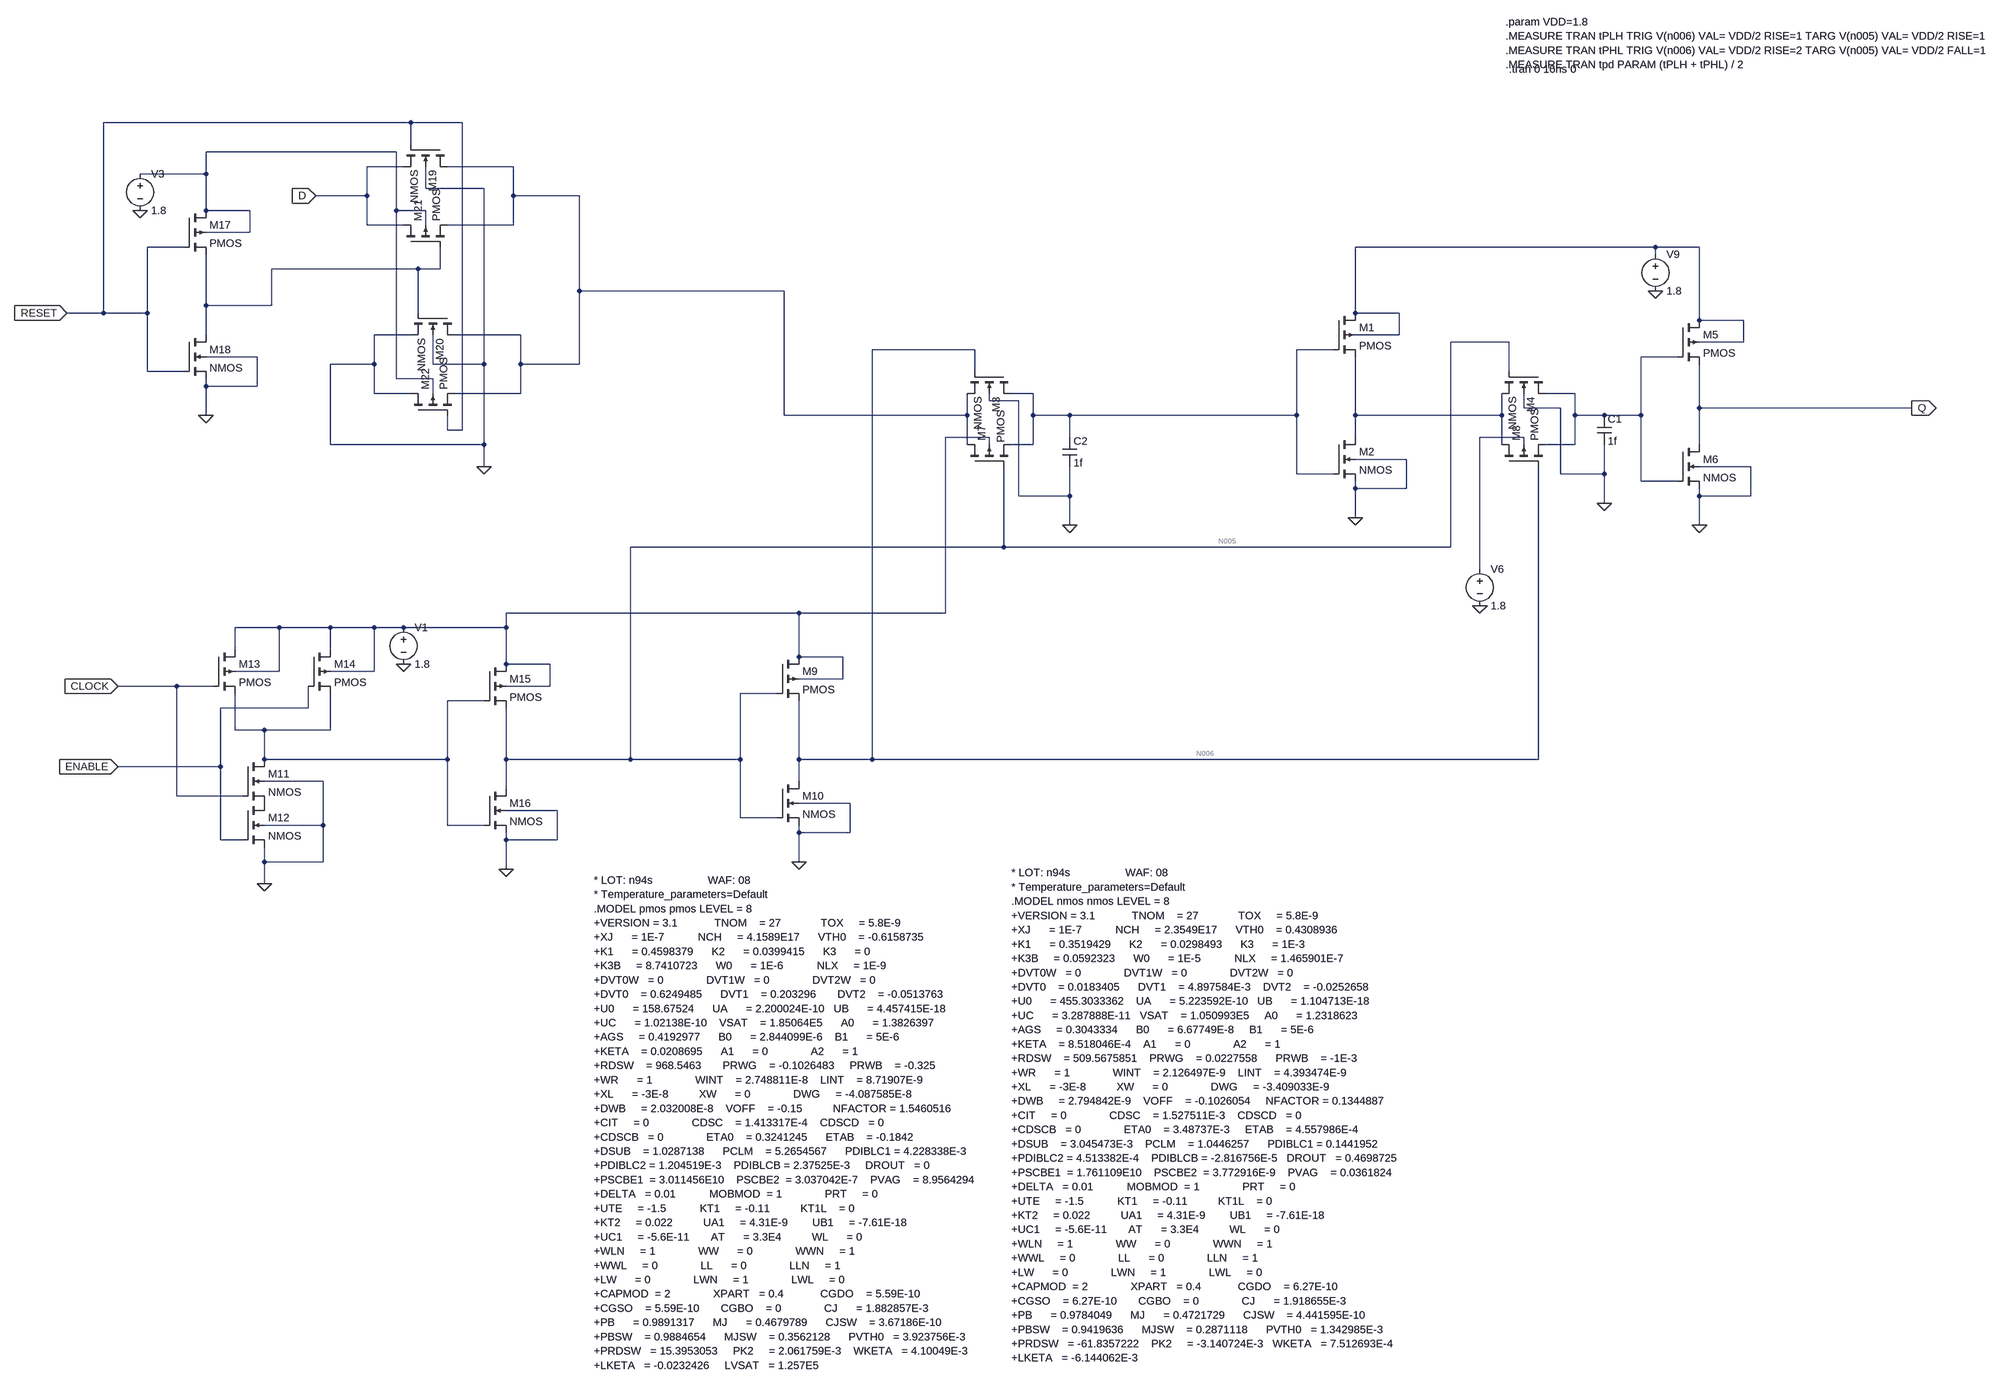
[diagram p0: schematic DFF_TG_INV_Ctrls.asc]
DFF_TG_INV_Ctrls.asc, the LTspice schematic file:
Version 4
SHEET 1 1972 1916
WIRE -3360 -736 -4032 -736
WIRE -3248 -736 -3360 -736
WIRE -3360 -688 -3360 -736
WIRE -3392 -672 -3808 -672
WIRE -3376 -640 -3456 -640
WIRE -3136 -640 -3280 -640
WIRE -3808 -624 -3808 -672
WIRE -3808 -624 -3952 -624
WIRE -3328 -592 -3328 -640
WIRE -3200 -592 -3328 -592
WIRE -3456 -576 -3456 -640
WIRE -3456 -576 -3568 -576
WIRE -3136 -576 -3136 -640
WIRE -2992 -576 -3136 -576
WIRE -3808 -544 -3808 -624
WIRE -3712 -544 -3808 -544
WIRE -3392 -544 -3392 -672
WIRE -3328 -544 -3392 -544
WIRE -3456 -512 -3456 -576
WIRE -3376 -512 -3456 -512
WIRE -3328 -512 -3328 -544
WIRE -3136 -512 -3136 -576
WIRE -3136 -512 -3280 -512
WIRE -3712 -496 -3712 -544
WIRE -3712 -496 -3808 -496
WIRE -3856 -464 -3936 -464
WIRE -640 -464 -1296 -464
WIRE -544 -464 -640 -464
WIRE -640 -448 -640 -464
WIRE -3344 -416 -3664 -416
WIRE -3296 -416 -3296 -464
WIRE -3296 -416 -3344 -416
WIRE -2992 -368 -2992 -576
WIRE -2544 -368 -2992 -368
WIRE -3808 -336 -3808 -448
WIRE -3664 -336 -3664 -416
WIRE -3664 -336 -3808 -336
WIRE -4032 -320 -4032 -736
WIRE -4032 -320 -4112 -320
WIRE -3936 -320 -3936 -464
WIRE -3936 -320 -4032 -320
WIRE -3344 -320 -3344 -416
WIRE -1296 -320 -1296 -464
WIRE -1200 -320 -1296 -320
WIRE -544 -304 -544 -464
WIRE -448 -304 -544 -304
WIRE -3808 -272 -3808 -336
WIRE -3360 -272 -3440 -272
WIRE -3120 -272 -3264 -272
WIRE -1200 -272 -1200 -320
WIRE -1200 -272 -1296 -272
WIRE -960 -256 -1088 -256
WIRE -448 -256 -448 -304
WIRE -448 -256 -544 -256
WIRE -2128 -240 -2352 -240
WIRE -1344 -240 -1424 -240
WIRE -3696 -224 -3808 -224
WIRE -592 -224 -672 -224
WIRE -3440 -208 -3440 -272
WIRE -3440 -208 -3536 -208
WIRE -3312 -208 -3312 -272
WIRE -3200 -208 -3200 -592
WIRE -3200 -208 -3312 -208
WIRE -3120 -208 -3120 -272
WIRE -2992 -208 -2992 -368
WIRE -2992 -208 -3120 -208
WIRE -3936 -192 -3936 -320
WIRE -3856 -192 -3936 -192
WIRE -2128 -192 -2128 -240
WIRE -960 -192 -960 -256
WIRE -3392 -176 -3392 -544
WIRE -3312 -176 -3392 -176
WIRE -3808 -160 -3808 -176
WIRE -3696 -160 -3696 -224
WIRE -3696 -160 -3808 -160
WIRE -3440 -144 -3440 -208
WIRE -3360 -144 -3440 -144
WIRE -3312 -144 -3312 -176
WIRE -3120 -144 -3120 -208
WIRE -3120 -144 -3264 -144
WIRE -2000 -144 -2048 -144
WIRE -816 -144 -880 -144
WIRE -2096 -128 -2096 -144
WIRE -2032 -128 -2096 -128
WIRE -928 -112 -928 -144
WIRE -848 -112 -928 -112
WIRE -544 -112 -544 -208
WIRE -80 -112 -544 -112
WIRE -3808 -96 -3808 -160
WIRE -2544 -96 -2544 -368
WIRE -2144 -96 -2144 -144
WIRE -2144 -96 -2544 -96
WIRE -2000 -96 -2000 -144
WIRE -1920 -96 -2000 -96
WIRE -1424 -96 -1424 -240
WIRE -1424 -96 -1920 -96
WIRE -1296 -96 -1296 -224
WIRE -976 -96 -976 -144
WIRE -976 -96 -1296 -96
WIRE -816 -96 -816 -144
WIRE -752 -96 -816 -96
WIRE -672 -96 -672 -224
WIRE -672 -96 -752 -96
WIRE -3280 -64 -3280 -96
WIRE -3248 -64 -3248 -736
WIRE -3248 -64 -3280 -64
WIRE -2096 -48 -2192 -48
WIRE -1920 -48 -1920 -96
WIRE -1296 -48 -1296 -96
WIRE -928 -48 -1024 -48
WIRE -3536 -32 -3536 -208
WIRE -3200 -32 -3200 -208
WIRE -3200 -32 -3536 -32
WIRE -2144 -32 -2144 -96
WIRE -2096 -32 -2096 -48
WIRE -2000 -32 -2000 -96
WIRE -2000 -32 -2048 -32
WIRE -976 -32 -976 -96
WIRE -928 -32 -928 -48
WIRE -816 -32 -816 -96
WIRE -816 -32 -880 -32
WIRE -544 -32 -544 -112
WIRE -1184 0 -1296 0
WIRE -3200 16 -3200 -32
WIRE -432 16 -544 16
WIRE -1424 32 -1424 -96
WIRE -1344 32 -1424 32
WIRE -848 32 -848 -112
WIRE -752 32 -752 -32
WIRE -752 32 -848 32
WIRE -672 48 -672 -96
WIRE -592 48 -672 48
WIRE -1296 64 -1296 48
WIRE -1184 64 -1184 0
WIRE -1184 64 -1296 64
WIRE -2032 80 -2032 -128
WIRE -1920 80 -1920 16
WIRE -1920 80 -2032 80
WIRE -544 80 -544 64
WIRE -432 80 -432 16
WIRE -432 80 -544 80
WIRE -752 96 -752 32
WIRE -1296 128 -1296 64
WIRE -1920 144 -1920 80
WIRE -544 144 -544 80
WIRE -2064 192 -2064 16
WIRE -2064 192 -2880 192
WIRE -1088 192 -1088 -256
WIRE -1088 192 -2064 192
WIRE -1024 240 -1024 -48
WIRE -2512 336 -3152 336
WIRE -2192 336 -2192 -48
WIRE -2192 336 -2512 336
WIRE -3648 368 -3744 368
WIRE -3536 368 -3648 368
WIRE -3440 368 -3536 368
WIRE -3376 368 -3440 368
WIRE -3152 368 -3152 336
WIRE -3152 368 -3376 368
WIRE -3744 416 -3744 368
WIRE -3536 416 -3536 368
WIRE -2512 432 -2512 336
WIRE -2416 432 -2512 432
WIRE -3152 448 -3152 368
WIRE -3056 448 -3152 448
WIRE -3648 464 -3648 368
WIRE -3648 464 -3744 464
WIRE -3440 464 -3440 368
WIRE -3440 464 -3536 464
WIRE -2416 480 -2416 432
WIRE -2416 480 -2512 480
WIRE -3872 496 -4000 496
WIRE -3792 496 -3872 496
WIRE -3056 496 -3056 448
WIRE -3056 496 -3152 496
WIRE -2560 512 -2640 512
WIRE -3200 528 -3280 528
WIRE -3584 544 -3584 496
WIRE -3584 544 -3776 544
WIRE -3744 592 -3744 512
WIRE -3680 592 -3744 592
WIRE -3536 592 -3536 512
WIRE -3536 592 -3680 592
WIRE -3680 656 -3680 592
WIRE -3280 656 -3280 528
WIRE -3280 656 -3680 656
WIRE -3152 656 -3152 544
WIRE -2880 656 -2880 192
WIRE -2880 656 -3152 656
WIRE -2640 656 -2640 512
WIRE -2640 656 -2880 656
WIRE -2512 656 -2512 528
WIRE -2352 656 -2352 -240
WIRE -2352 656 -2512 656
WIRE -896 656 -896 16
WIRE -896 656 -2352 656
WIRE -3776 672 -3776 544
WIRE -3776 672 -4000 672
WIRE -3552 704 -3680 704
WIRE -2512 704 -2512 656
WIRE -3152 720 -3152 656
WIRE -3872 736 -3872 496
WIRE -3728 736 -3872 736
WIRE -2400 752 -2512 752
WIRE -3040 768 -3152 768
WIRE -2640 784 -2640 656
WIRE -2560 784 -2640 784
WIRE -3552 800 -3552 704
WIRE -3552 800 -3680 800
WIRE -3280 800 -3280 656
WIRE -3200 800 -3280 800
WIRE -2512 816 -2512 800
WIRE -2400 816 -2400 752
WIRE -2400 816 -2512 816
WIRE -3776 832 -3776 672
WIRE -3728 832 -3776 832
WIRE -3152 832 -3152 816
WIRE -3040 832 -3040 768
WIRE -3040 832 -3152 832
WIRE -3680 880 -3680 848
WIRE -3552 880 -3552 800
WIRE -3552 880 -3680 880
WIRE -2512 880 -2512 816
WIRE -3152 896 -3152 832
WIRE -3680 928 -3680 880
FLAG -1296 128 0
FLAG -544 144 0
FLAG -752 96 0
FLAG -1920 144 0
FLAG -2512 880 0
FLAG -80 -112 Q
IOPIN -80 -112 Out
FLAG -3376 448 0
FLAG -3680 928 0
FLAG -4000 672 ENABLE
IOPIN -4000 672 In
FLAG -4000 496 CLOCK
IOPIN -4000 496 In
FLAG -3152 896 0
FLAG -3952 -544 0
FLAG -4112 -320 RESET
IOPIN -4112 -320 In
FLAG -3808 -96 0
FLAG -3200 16 0
FLAG -3568 -576 D
IOPIN -3568 -576 In
FLAG -1024 320 0
FLAG -640 -368 0
SYMBOL nmos4 -2048 -192 R90
SYMATTR InstName M3
SYMATTR Value2 l=180n w=440n
SYMBOL nmos4 -880 -192 R90
SYMATTR InstName M4
SYMATTR Value2 l=180n w=440n
SYMBOL Cap -768 -96 R0
SYMATTR InstName C1
SYMATTR Value 1f
SYMBOL pmos4 -1344 -320 R0
SYMATTR InstName M1
SYMATTR Value2 l=180n w=880n
SYMBOL nmos4 -1344 -48 R0
SYMATTR InstName M2
SYMATTR Value2 l=180n w=440n
SYMBOL pmos4 -592 -304 R0
SYMATTR InstName M5
SYMATTR Value2 l=180n w=880n
SYMBOL nmos4 -592 -32 R0
SYMATTR InstName M6
SYMATTR Value2 l=180n w=440n
SYMBOL pmos4 -2144 16 R270
WINDOW 3 52 74 Left 2
SYMATTR InstName M7
SYMATTR Value2 l=180n w=440n
SYMBOL pmos4 -976 16 R270
SYMATTR InstName M8
SYMATTR Value2 l=180n w=440n
SYMBOL Cap -1936 -48 R0
SYMATTR InstName C2
SYMATTR Value 1f
SYMBOL pmos4 -2560 432 R0
SYMATTR InstName M9
SYMATTR Value2 l=180n w=880n
SYMBOL nmos4 -2560 704 R0
SYMATTR InstName M10
SYMATTR Value2 l=180n w=440n
SYMBOL nmos4 -3728 656 R0
SYMATTR InstName M11
SYMATTR Value2 l=180n w=880n
SYMBOL nmos4 -3728 752 R0
SYMATTR InstName M12
SYMATTR Value2 l=180n w=880n
SYMBOL pmos4 -3792 416 R0
SYMATTR InstName M13
SYMATTR Value2 l=180n w=880n
SYMBOL pmos4 -3584 416 R0
SYMATTR InstName M14
SYMATTR Value2 l=180n w=880n
SYMBOL Voltage -3376 352 R0
SYMATTR InstName V1
SYMATTR Value 1.8
SYMBOL pmos4 -3200 448 R0
SYMATTR InstName M15
SYMATTR Value2 l=180n w=880n
SYMBOL nmos4 -3200 720 R0
SYMATTR InstName M16
SYMATTR Value2 l=180n w=440n
SYMBOL Voltage -3952 -640 R0
SYMATTR InstName V3
SYMATTR Value 1.8
SYMBOL pmos4 -3856 -544 R0
SYMATTR InstName M17
SYMATTR Value2 l=180n w=880n
SYMBOL nmos4 -3856 -272 R0
SYMATTR InstName M18
SYMATTR Value2 l=180n w=440n
SYMBOL nmos4 -3280 -688 R90
SYMATTR InstName M19
SYMATTR Value2 l=180n w=440n
SYMBOL nmos4 -3264 -320 R90
SYMATTR InstName M20
SYMATTR Value2 l=180n w=440n
SYMBOL pmos4 -3376 -464 R270
SYMATTR InstName M21
SYMATTR Value2 l=180n w=440n
SYMBOL pmos4 -3360 -96 R270
SYMATTR InstName M22
SYMATTR Value2 l=180n w=440n
SYMBOL Voltage -1024 224 R0
SYMATTR InstName V6
SYMATTR Value 1.8
SYMBOL Voltage -640 -464 R0
SYMATTR InstName V9
SYMATTR Value 1.8
TEXT -960 -856 Left 2 !.tran 0 16ns 0
TEXT -968 -960 Left 2 !.param VDD=1.8\n.MEASURE TRAN tPLH TRIG V(n006) VAL= VDD/2 RISE=1 TARG V(n005) VAL= VDD/2 RISE=1\n.MEASURE TRAN tPHL TRIG V(n006) VAL= VDD/2 RISE=2 TARG V(n005) VAL= VDD/2 FALL=1\n.MEASURE TRAN tpd PARAM (tPLH + tPHL) / 2
TEXT -2048 904 Left 2 !* LOT: n94s                  WAF: 08\n* Temperature_parameters=Default\n.MODEL nmos nmos LEVEL = 8\n+VERSION = 3.1            TNOM    = 27             TOX     = 5.8E-9\n+XJ      = 1E-7           NCH     = 2.3549E17      VTH0    = 0.4308936\n+K1      = 0.3519429      K2      = 0.0298493      K3      = 1E-3\n+K3B     = 0.0592323      W0      = 1E-5           NLX     = 1.465901E-7\n+DVT0W   = 0              DVT1W   = 0              DVT2W   = 0\n+DVT0    = 0.0183405      DVT1    = 4.897584E-3    DVT2    = -0.0252658\n+U0      = 455.3033362    UA      = 5.223592E-10   UB      = 1.104713E-18\n+UC      = 3.287888E-11   VSAT    = 1.050993E5     A0      = 1.2318623\n+AGS     = 0.3043334      B0      = 6.67749E-8     B1      = 5E-6\n+KETA    = 8.518046E-4    A1      = 0              A2      = 1\n+RDSW    = 509.5675851    PRWG    = 0.0227558      PRWB    = -1E-3\n+WR      = 1              WINT    = 2.126497E-9    LINT    = 4.393474E-9\n+XL      = -3E-8          XW      = 0              DWG     = -3.409033E-9\n+DWB     = 2.794842E-9    VOFF    = -0.1026054     NFACTOR = 0.1344887\n+CIT     = 0              CDSC    = 1.527511E-3    CDSCD   = 0\n+CDSCB   = 0              ETA0    = 3.48737E-3     ETAB    = 4.557986E-4\n+DSUB    = 3.045473E-3    PCLM    = 1.0446257      PDIBLC1 = 0.1441952\n+PDIBLC2 = 4.513382E-4    PDIBLCB = -2.816756E-5   DROUT   = 0.4698725\n+PSCBE1  = 1.761109E10    PSCBE2  = 3.772916E-9    PVAG    = 0.0361824\n+DELTA   = 0.01           MOBMOD  = 1              PRT     = 0\n+UTE     = -1.5           KT1     = -0.11          KT1L    = 0\n+KT2     = 0.022          UA1     = 4.31E-9        UB1     = -7.61E-18\n+UC1     = -5.6E-11       AT      = 3.3E4          WL      = 0\n+WLN     = 1              WW      = 0              WWN     = 1\n+WWL     = 0              LL      = 0              LLN     = 1\n+LW      = 0              LWN     = 1              LWL     = 0\n+CAPMOD  = 2              XPART   = 0.4            CGDO    = 6.27E-10\n+CGSO    = 6.27E-10       CGBO    = 0              CJ      = 1.918655E-3\n+PB      = 0.9784049      MJ      = 0.4721729      CJSW    = 4.441595E-10\n+PBSW    = 0.9419636      MJSW    = 0.2871118      PVTH0   = 1.342985E-3\n+PRDSW   = -61.8357222    PK2     = -3.140724E-3   WKETA   = 7.512693E-4\n+LKETA   = -6.144062E-3
TEXT -2960 920 Left 2 !* LOT: n94s                  WAF: 08\n* Temperature_parameters=Default\n.MODEL pmos pmos LEVEL = 8\n+VERSION = 3.1            TNOM    = 27             TOX     = 5.8E-9\n+XJ      = 1E-7           NCH     = 4.1589E17      VTH0    = -0.6158735\n+K1      = 0.4598379      K2      = 0.0399415      K3      = 0\n+K3B     = 8.7410723      W0      = 1E-6           NLX     = 1E-9\n+DVT0W   = 0              DVT1W   = 0              DVT2W   = 0\n+DVT0    = 0.6249485      DVT1    = 0.203296       DVT2    = -0.0513763\n+U0      = 158.67524      UA      = 2.200024E-10   UB      = 4.457415E-18\n+UC      = 1.02138E-10    VSAT    = 1.85064E5      A0      = 1.3826397\n+AGS     = 0.4192977      B0      = 2.844099E-6    B1      = 5E-6\n+KETA    = 0.0208695      A1      = 0              A2      = 1\n+RDSW    = 968.5463       PRWG    = -0.1026483     PRWB    = -0.325\n+WR      = 1              WINT    = 2.748811E-8    LINT    = 8.71907E-9\n+XL      = -3E-8          XW      = 0              DWG     = -4.087585E-8\n+DWB     = 2.032008E-8    VOFF    = -0.15          NFACTOR = 1.5460516\n+CIT     = 0              CDSC    = 1.413317E-4    CDSCD   = 0\n+CDSCB   = 0              ETA0    = 0.3241245      ETAB    = -0.1842\n+DSUB    = 1.0287138      PCLM    = 5.2654567      PDIBLC1 = 4.228338E-3\n+PDIBLC2 = 1.204519E-3    PDIBLCB = 2.37525E-3     DROUT   = 0\n+PSCBE1  = 3.011456E10    PSCBE2  = 3.037042E-7    PVAG    = 8.9564294\n+DELTA   = 0.01           MOBMOD  = 1              PRT     = 0\n+UTE     = -1.5           KT1     = -0.11          KT1L    = 0\n+KT2     = 0.022          UA1     = 4.31E-9        UB1     = -7.61E-18\n+UC1     = -5.6E-11       AT      = 3.3E4          WL      = 0\n+WLN     = 1              WW      = 0              WWN     = 1\n+WWL     = 0              LL      = 0              LLN     = 1\n+LW      = 0              LWN     = 1              LWL     = 0\n+CAPMOD  = 2              XPART   = 0.4            CGDO    = 5.59E-10\n+CGSO    = 5.59E-10       CGBO    = 0              CJ      = 1.882857E-3\n+PB      = 0.9891317      MJ      = 0.4679789      CJSW    = 3.67186E-10\n+PBSW    = 0.9884654      MJSW    = 0.3562128      PVTH0   = 3.923756E-3\n+PRDSW   = 15.3953053     PK2     = 2.061759E-3    WKETA   = 4.10049E-3\n+LKETA   = -0.0232426     LVSAT   = 1.257E5

The netlist it stands for:
* DFF_TG_INV_Ctrls.asc
M3 N007 N006 N002 0 NMOS l=180n w=440n
M4 N008 N005 N009 0 NMOS l=180n w=440n
C1 N008 0 1f
M1 N003 N007 N009 N003 PMOS l=180n w=880n
M2 N009 N007 0 0 NMOS l=180n w=440n
M5 N003 N008 Q N003 PMOS l=180n w=880n
M6 Q N008 0 0 NMOS l=180n w=440n
M7 N002 N005 N007 N010 PMOS l=180n w=440n
M8 N009 N006 N008 N011 PMOS l=180n w=440n
C2 N007 0 1f
M9 N010 N005 N006 N010 PMOS l=180n w=880n
M10 N006 N005 0 0 NMOS l=180n w=440n
M11 N012 CLOCK P001 0 NMOS l=180n w=880n
M12 P001 ENABLE 0 0 NMOS l=180n w=880n
M13 N010 CLOCK N012 N010 PMOS l=180n w=880n
M14 N010 ENABLE N012 N010 PMOS l=180n w=880n
V1 N010 0 1.8
M15 N010 N012 N005 N010 PMOS l=180n w=880n
M16 N005 N012 0 0 NMOS l=180n w=440n
V3 N001 0 1.8
M17 N001 RESET N004 N001 PMOS l=180n w=880n
M18 N004 RESET 0 0 NMOS l=180n w=440n
M19 N002 RESET D 0 NMOS l=180n w=440n
M20 N002 N004 0 0 NMOS l=180n w=440n
M21 D N004 N002 N001 PMOS l=180n w=440n
M22 0 RESET N002 N001 PMOS l=180n w=440n
V6 N011 0 1.8
V9 N003 0 1.8
.model NMOS NMOS
.model PMOS PMOS
.lib standard.mos
.tran 0 16ns 0
.param VDD=1.8
.MEASURE TRAN tPLH TRIG V(n006) VAL= VDD/2 RISE=1 TARG V(n005) VAL= VDD/2 RISE=1
.MEASURE TRAN tPHL TRIG V(n006) VAL= VDD/2 RISE=2 TARG V(n005) VAL= VDD/2 FALL=1
.MEASURE TRAN tpd PARAM (tPLH + tPHL) / 2
* LOT: n94s                  WAF: 08
* Temperature_parameters=Default
.MODEL nmos nmos LEVEL = 8
+VERSION = 3.1            TNOM    = 27             TOX     = 5.8E-9
+XJ      = 1E-7           NCH     = 2.3549E17      VTH0    = 0.4308936
+K1      = 0.3519429      K2      = 0.0298493      K3      = 1E-3
+K3B     = 0.0592323      W0      = 1E-5           NLX     = 1.465901E-7
+DVT0W   = 0              DVT1W   = 0              DVT2W   = 0
+DVT0    = 0.0183405      DVT1    = 4.897584E-3    DVT2    = -0.0252658
+U0      = 455.3033362    UA      = 5.223592E-10   UB      = 1.104713E-18
+UC      = 3.287888E-11   VSAT    = 1.050993E5     A0      = 1.2318623
+AGS     = 0.3043334      B0      = 6.67749E-8     B1      = 5E-6
+KETA    = 8.518046E-4    A1      = 0              A2      = 1
+RDSW    = 509.5675851    PRWG    = 0.0227558      PRWB    = -1E-3
+WR      = 1              WINT    = 2.126497E-9    LINT    = 4.393474E-9
+XL      = -3E-8          XW      = 0              DWG     = -3.409033E-9
+DWB     = 2.794842E-9    VOFF    = -0.1026054     NFACTOR = 0.1344887
+CIT     = 0              CDSC    = 1.527511E-3    CDSCD   = 0
+CDSCB   = 0              ETA0    = 3.48737E-3     ETAB    = 4.557986E-4
+DSUB    = 3.045473E-3    PCLM    = 1.0446257      PDIBLC1 = 0.1441952
+PDIBLC2 = 4.513382E-4    PDIBLCB = -2.816756E-5   DROUT   = 0.4698725
+PSCBE1  = 1.761109E10    PSCBE2  = 3.772916E-9    PVAG    = 0.0361824
+DELTA   = 0.01           MOBMOD  = 1              PRT     = 0
+UTE     = -1.5           KT1     = -0.11          KT1L    = 0
+KT2     = 0.022          UA1     = 4.31E-9        UB1     = -7.61E-18
+UC1     = -5.6E-11       AT      = 3.3E4          WL      = 0
+WLN     = 1              WW      = 0              WWN     = 1
+WWL     = 0              LL      = 0              LLN     = 1
+LW      = 0              LWN     = 1              LWL     = 0
+CAPMOD  = 2              XPART   = 0.4            CGDO    = 6.27E-10
+CGSO    = 6.27E-10       CGBO    = 0              CJ      = 1.918655E-3
+PB      = 0.9784049      MJ      = 0.4721729      CJSW    = 4.441595E-10
+PBSW    = 0.9419636      MJSW    = 0.2871118      PVTH0   = 1.342985E-3
+PRDSW   = -61.8357222    PK2     = -3.140724E-3   WKETA   = 7.512693E-4
+LKETA   = -6.144062E-3
* LOT: n94s                  WAF: 08
* Temperature_parameters=Default
.MODEL pmos pmos LEVEL = 8
+VERSION = 3.1            TNOM    = 27             TOX     = 5.8E-9
+XJ      = 1E-7           NCH     = 4.1589E17      VTH0    = -0.6158735
+K1      = 0.4598379      K2      = 0.0399415      K3      = 0
+K3B     = 8.7410723      W0      = 1E-6           NLX     = 1E-9
+DVT0W   = 0              DVT1W   = 0              DVT2W   = 0
+DVT0    = 0.6249485      DVT1    = 0.203296       DVT2    = -0.0513763
+U0      = 158.67524      UA      = 2.200024E-10   UB      = 4.457415E-18
+UC      = 1.02138E-10    VSAT    = 1.85064E5      A0      = 1.3826397
+AGS     = 0.4192977      B0      = 2.844099E-6    B1      = 5E-6
+KETA    = 0.0208695      A1      = 0              A2      = 1
+RDSW    = 968.5463       PRWG    = -0.1026483     PRWB    = -0.325
+WR      = 1              WINT    = 2.748811E-8    LINT    = 8.71907E-9
+XL      = -3E-8          XW      = 0              DWG     = -4.087585E-8
+DWB     = 2.032008E-8    VOFF    = -0.15          NFACTOR = 1.5460516
+CIT     = 0              CDSC    = 1.413317E-4    CDSCD   = 0
+CDSCB   = 0              ETA0    = 0.3241245      ETAB    = -0.1842
+DSUB    = 1.0287138      PCLM    = 5.2654567      PDIBLC1 = 4.228338E-3
+PDIBLC2 = 1.204519E-3    PDIBLCB = 2.37525E-3     DROUT   = 0
+PSCBE1  = 3.011456E10    PSCBE2  = 3.037042E-7    PVAG    = 8.9564294
+DELTA   = 0.01           MOBMOD  = 1              PRT     = 0
+UTE     = -1.5           KT1     = -0.11          KT1L    = 0
+KT2     = 0.022          UA1     = 4.31E-9        UB1     = -7.61E-18
+UC1     = -5.6E-11       AT      = 3.3E4          WL      = 0
+WLN     = 1              WW      = 0              WWN     = 1
+WWL     = 0              LL      = 0              LLN     = 1
+LW      = 0              LWN     = 1              LWL     = 0
+CAPMOD  = 2              XPART   = 0.4            CGDO    = 5.59E-10
+CGSO    = 5.59E-10       CGBO    = 0              CJ      = 1.882857E-3
+PB      = 0.9891317      MJ      = 0.4679789      CJSW    = 3.67186E-10
+PBSW    = 0.9884654      MJSW    = 0.3562128      PVTH0   = 3.923756E-3
+PRDSW   = 15.3953053     PK2     = 2.061759E-3    WKETA   = 4.10049E-3
+LKETA   = -0.0232426     LVSAT   = 1.257E5
.backanno
.end